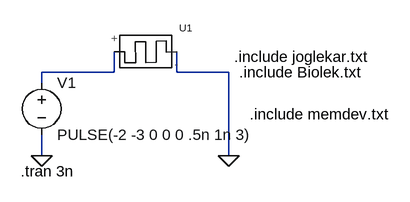
[diagram p0: schematic schm_jogelekar.asc]
schm_jogelekar.asc, the LTspice schematic file:
Version 4
SHEET 1 880 680
WIRE 112 144 112 112
WIRE 112 144 0 144
WIRE 208 144 208 112
WIRE 288 144 208 144
WIRE 0 160 0 144
WIRE 0 272 0 240
WIRE 288 272 288 144
FLAG 0 272 0
FLAG 288 272 0
SYMBOL voltage 0 144 R0
WINDOW 123 0 0 Left 2
WINDOW 39 0 0 Left 2
SYMATTR InstName V1
SYMATTR Value PULSE(-2 -3 0 0 0 .5n 1n 3)
SYMBOL memristormodel 192 112 R0
SYMATTR InstName U1
SYMATTR Value MEM_YAKOPCIC
TEXT 296 120 Left 2 !.include joglekar.txt
TEXT -32 296 Left 2 !.tran 3n
TEXT 304 144 Left 2 !.include Biolek.txt
TEXT 320 208 Left 2 !.include memdev.txt

The netlist it stands for:
* schm_jogelekar.asc
V1 N001 0 PULSE(-2 -3 0 0 0 .5n 1n 3)
XU1 N001 0 M MEM_YAKOPCIC  ; pins + -
.include joglekar.txt
.tran 3n
.include Biolek.txt
.include memdev.txt
.backanno
.end